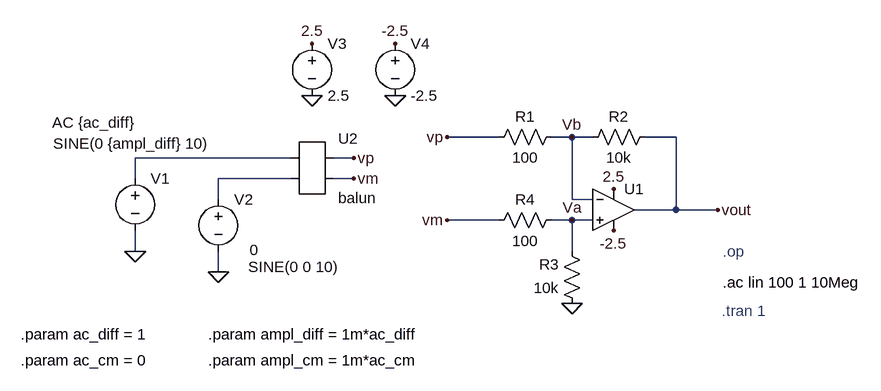
[diagram p0: schematic diff_amp.asc]
diff_amp.asc, the LTspice schematic file:
Version 4
SHEET 1 880 680
WIRE 80 48 0 48
WIRE 192 48 160 48
WIRE 224 48 192 48
WIRE 352 48 304 48
WIRE -240 80 -480 80
WIRE -144 80 -176 80
WIRE -480 112 -480 80
WIRE -240 112 -352 112
WIRE -144 112 -176 112
WIRE -352 144 -352 112
WIRE 192 144 192 48
WIRE 224 144 192 144
WIRE 352 160 352 48
WIRE 352 160 288 160
WIRE 416 160 352 160
WIRE 80 176 0 176
WIRE 192 176 160 176
WIRE 224 176 192 176
WIRE -480 224 -480 192
WIRE 192 224 192 176
WIRE -352 256 -352 224
FLAG 192 304 0
FLAG -80 -16 0
FLAG -208 -16 0
FLAG -208 -96 2.5
FLAG -80 -96 -2.5
FLAG 256 128 2.5
FLAG 256 192 -2.5
FLAG 416 160 vout
FLAG 192 176 Va
FLAG 192 48 Vb
FLAG -480 224 0
FLAG -352 256 0
FLAG -144 80 vp
FLAG 0 48 vp
FLAG -144 112 vm
FLAG 0 176 vm
SYMBOL Opamps\\UniversalOpamp2 256 160 R0
SYMATTR InstName U1
SYMATTR SpiceModel level.1
SYMATTR Value2 Avol=10Meg GBW=1Meg Slew=10Meg
SYMBOL res 176 32 R90
WINDOW 0 0 56 VBottom 2
WINDOW 3 32 56 VTop 2
SYMATTR InstName R1
SYMATTR Value 100
SYMBOL res 320 32 R90
WINDOW 0 0 56 VBottom 2
WINDOW 3 32 56 VTop 2
SYMATTR InstName R2
SYMATTR Value 10k
SYMBOL res 208 320 R180
WINDOW 0 36 76 Left 2
WINDOW 3 36 40 Left 2
SYMATTR InstName R3
SYMATTR Value 10k
SYMBOL res 64 192 R270
WINDOW 0 32 56 VTop 2
WINDOW 3 0 56 VBottom 2
SYMATTR InstName R4
SYMATTR Value 100
SYMBOL voltage -208 -112 R0
WINDOW 123 0 0 Left 0
WINDOW 39 0 0 Left 0
SYMATTR InstName V3
SYMATTR Value 2.5
SYMBOL voltage -80 -112 R0
WINDOW 123 0 0 Left 0
WINDOW 39 0 0 Left 0
SYMATTR InstName V4
SYMATTR Value -2.5
SYMBOL AutoGenerated\\balun -208 96 R0
SYMATTR InstName U2
SYMBOL voltage -480 96 R0
WINDOW 3 -126 -38 Left 2
WINDOW 123 -128 -70 Left 2
WINDOW 39 0 0 Left 0
SYMATTR Value SINE(0 {ampl_diff} 10)
SYMATTR Value2 AC {ac_diff}
SYMATTR InstName V1
SYMBOL voltage -352 128 R0
WINDOW 123 48 94 Left 2
WINDOW 39 0 0 Left 0
WINDOW 3 46 120 Left 2
SYMATTR Value2 0
SYMATTR InstName V2
SYMATTR Value SINE(0 0 10)
TEXT 424 272 Left 2 !.ac lin 100 1 10Meg
TEXT 424 224 Left 2 ;.op
TEXT -656 352 Left 2 !.param ac_diff = 1
TEXT -656 392 Left 2 !.param ac_cm = 0
TEXT -368 352 Left 2 !.param ampl_diff = 1m*ac_diff
TEXT -368 392 Left 2 !.param ampl_cm = 1m*ac_cm
TEXT 422 316 Left 2 ;.tran 1

The netlist it stands for:
* diff_amp.asc
XU1 Va Vb 2.5 -2.5 vout level.1 Avol=10Meg GBW=1Meg Slew=10Meg ilimit=25m rail=0 Vos=0 phimargin=45 en=0 enk=0 in=0 ink=0 Rin=500Meg  ; pins IN+ IN- V+ V- OUT
R1 Vb vp 100
R2 vout Vb 10k
R3 0 Va 10k
R4 vm Va 100
V3 2.5 0 2.5
V4 -2.5 0 -2.5
* U2: balun (symbol AutoGenerated\balun not available, pins judged from their places): pin1=N001 pin2=N002 pin3=vp pin4=vm
V1 N001 0 SINE(0 {ampl_diff} 10) AC {ac_diff}
V2 N002 0 SINE(0 0 10) 0
.ac lin 100 1 10Meg
* .op
.param ac_diff = 1
.param ac_cm = 0
.param ampl_diff = 1m*ac_diff
.param ampl_cm = 1m*ac_cm
* .tran 1
.lib UniversalOpamps2.sub
.backanno
.end